# Altium project Controller-RK3562.PrjPcb (part 7 of 8)

## Sheet ANTI-FALL-IR-SENSORs.SchDoc
size A4; SheetNumber: 19; SheetTotal: 32
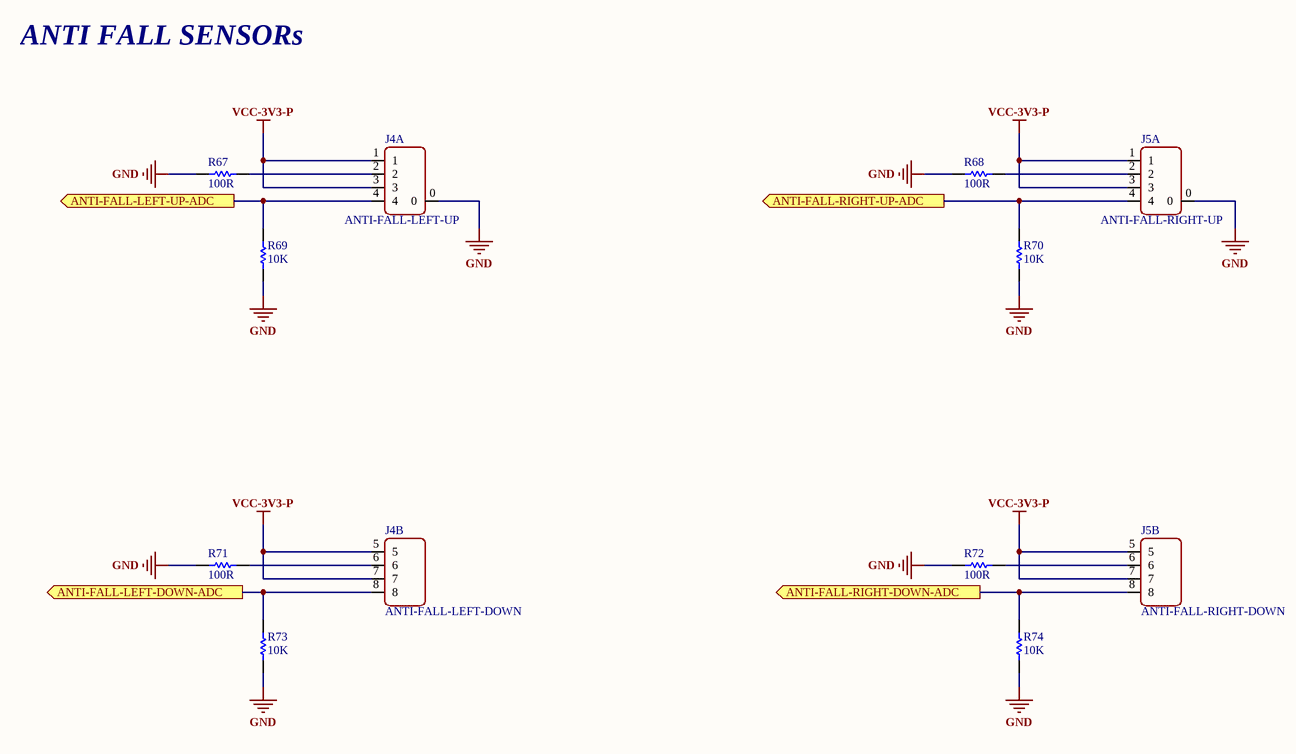
[diagram p24: ANTI-FALL-IR-SENSORs.SchDoc]

### Parts
J4  ANTI-FALL-LEFT-UP  [CONN-SMD_8P-P1.50_ZX-ZH1.5-8PWT]  (parts A,B of 2)
J5  ANTI-FALL-RIGHT-UP  [CONN-SMD_8P-P1.50_ZX-ZH1.5-8PWT]  (parts A,B of 2)
R67  100R  [RES-0402]
R68  100R  [RES-0402]
R69  10K  [RES-0402]
R70  10K  [RES-0402]
R71  100R  [RES-0402]
R72  100R  [RES-0402]
R73  10K  [RES-0402]
R74  10K  [RES-0402]

### Ports
ANTI-FALL-LEFT-DOWN-ADC (out, see Controller-RK3562-TOP[3A], STM32G070RBT6[1B]), ANTI-FALL-LEFT-UP-ADC (out, see Controller-RK3562-TOP[3A], STM32G070RBT6[1B]), ANTI-FALL-RIGHT-DOWN-ADC (out, see Controller-RK3562-TOP[3A], STM32G070RBT6[1B]), ANTI-FALL-RIGHT-UP-ADC (out, see Controller-RK3562-TOP[3A], STM32G070RBT6[1B])

### Nets
GND: J4.0 J5.0 R67.1 R68.1 R69.1 R70.1 R71.1 R72.1 R73.1 R74.1
VCC-3V3-P: J4.1 J4.3 J4.5 J4.7 J5.1 J5.3 J5.5 J5.7
NetJ4_2: J4.2 R67.2
NetJ4_4: J4.4 R69.2 ; port ANTI-FALL-LEFT-UP-ADC
NetJ4_6: J4.6 R71.2
NetJ4_8: J4.8 R73.2 ; port ANTI-FALL-LEFT-DOWN-ADC
NetJ5_2: J5.2 R68.2
NetJ5_4: J5.4 R70.2 ; port ANTI-FALL-RIGHT-UP-ADC
NetJ5_6: J5.6 R72.2
NetJ5_8: J5.8 R74.2 ; port ANTI-FALL-RIGHT-DOWN-ADC

### Notes on the sheet
- ANTI FALL SENSORs

### Library data of the parts
J4 J5 = HDRx8-2: ZX-ZH1.5-8PWT; Manufacturer: *; SupplierPartNumber: *; Supplier: *; VoltageRate: *
R67-R74 = Resistor-1: ManufacturingPartNumber: *; Manufacturer: *; SupplierPartNumber: *; Supplier: *; VoltageRate: *

## Sheet SIDE-PROXIMITY-IR-SENSOR .SchDoc
size A4; SheetNumber: 20; SheetTotal: 32
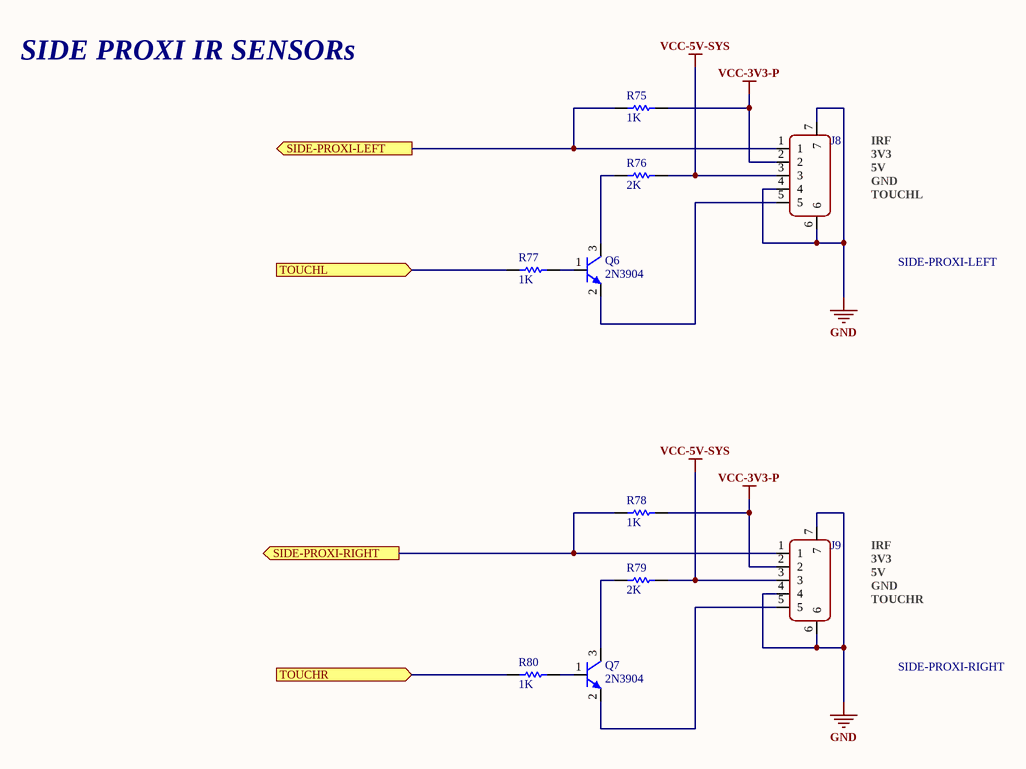
[diagram p25: SIDE-PROXIMITY-IR-SENSOR .SchDoc]

### Parts
J8  SIDE-PROXI-LEFT  [CONN-SMD_5P-P1.50_ZX-ZH1.5-5PWT]
J9  SIDE-PROXI-RIGHT  [CONN-SMD_5P-P1.50_ZX-ZH1.5-5PWT]
Q6  2N3904  [SOT23-3D]
Q7  2N3904  [SOT23-3D]
R75  1K  [RES-0402]
R76  2K  [RES-0402]
R77  1K  [RES-0402]
R78  1K  [RES-0402]
R79  2K  [RES-0402]
R80  1K  [RES-0402]

### Ports
SIDE-PROXI-LEFT (out, see Controller-RK3562-TOP[4A]), SIDE-PROXI-RIGHT (out, see Controller-RK3562-TOP[4A]), TOUCHL (in, see Controller-RK3562-TOP[4A]), TOUCHR (in, see Controller-RK3562-TOP[4A])

### Nets
GND: J8.4 J8.6 J8.7 J9.4 J9.6 J9.7
VCC-3V3-P: J8.2 J9.2 R75.2 R78.2
VCC-5V-SYS: J8.3 J9.3 R76.1 R79.1
NetJ8_1: J8.1 R75.1 ; port SIDE-PROXI-LEFT
NetJ8_5: J8.5 Q6.2(E)
NetJ9_1: J9.1 R78.1 ; port SIDE-PROXI-RIGHT
NetJ9_5: J9.5 Q7.2(E)
NetQ6_1: Q6.1(B) R77.2
NetQ6_3: Q6.3(C) R76.2
NetQ7_1: Q7.1(B) R80.2
NetQ7_3: Q7.3(C) R79.2
NetR77_1: R77.1 ; port TOUCHL
NetR80_1: R80.1 ; port TOUCHR

### Notes on the sheet
- SIDE PROXI IR SENSORs
- IRF
- 3V3
- 5V
- GND
- TOUCHL
- TOUCHR

### Library data of the parts
J8 J9 = HDRx5: ZX-ZH1.5-5PWT; ManufacturingPartNumber: *; Manufacturer: *; SupplierPartNumber: *; Supplier: *; VoltageRate: *
Q6 Q7 = NPN-SOT23: ManufacturingPartNumber: *; Manufacturer: *; SupplierPartNumber: *; Supplier: *; VoltageRate: *
R75-R80 = Resistor-1: ManufacturingPartNumber: *; Manufacturer: *; SupplierPartNumber: *; Supplier: *; VoltageRate: *

## Sheet WATER-PUMP .SchDoc
size A4; SheetNumber: 21; SheetTotal: 32
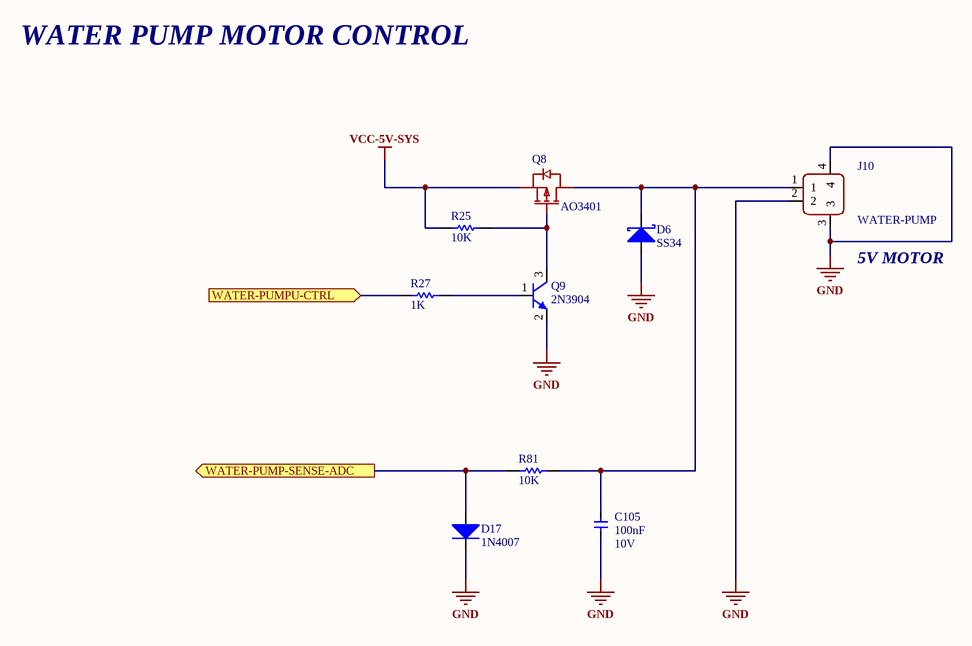
[diagram p26: WATER-PUMP .SchDoc]

### Parts
C105  100nF  VoltageRate: 10V  [CAP-0402]
D6  SS34  [SMA]
D17  1N4007  [SOD123]
J10  WATER-PUMP  [CONN-SMD_2P-P1.50_ZX-ZH1.5-2PWT]
Q8  AO3401  [SOT23-3D]
Q9  2N3904  [SOT23-3D]
R25  10K  [RES-0402]
R27  1K  [RES-0402]
R81  10K  [RES-0402]

### Ports
WATER-PUMP-SENSE-ADC (out, see Controller-RK3562-TOP[2B]), WATER-PUMPU-CTRL (in, see Controller-RK3562-TOP[2B])

### Nets
GND: C105.1 D6.1(A) D17.2(K) J10.2 J10.3 J10.4 Q9.2(E)
VCC-5V-SYS: Q8.2(S) R25.2
NetC105_2: C105.2 D6.2(K) J10.1 Q8.3(D) R81.1
NetD17_1: D17.1(A) R81.2 ; port WATER-PUMP-SENSE-ADC
NetQ8_1: Q8.1(G) Q9.3(C) R25.1
NetQ9_1: Q9.1(B) R27.1
NetR27_2: R27.2 ; port WATER-PUMPU-CTRL

### Notes on the sheet
- WATER PUMP MOTOR CONTROL
- (near J10) 5V MOTOR

### Library data of the parts
C105 = Capacitor-1: ManufacturingPartNumber: *; Manufacturer: *; SupplierPartNumber: *; Supplier: *
D6 = DIODE-2: ManufacturingPartNumber: *; Manufacturer: *; SupplierPartNumber: *; Supplier: *; VoltageRate: *
D17 = DIODE-1: ManufacturingPartNumber: *; Manufacturer: *; SupplierPartNumber: *; Supplier: *; VoltageRate: *
J10 = HDRx2: ZX-ZH1.5-2PWT; ManufacturingPartNumber: *; Manufacturer: *; SupplierPartNumber: *; Supplier: *; VoltageRate: *
Q8 = P-MOS-SOT23: ManufacturingPartNumber: *; Manufacturer: *; SupplierPartNumber: *; Supplier: *; VoltageRate: *
Q9 = NPN-SOT23: ManufacturingPartNumber: *; Manufacturer: *; SupplierPartNumber: *; Supplier: *; VoltageRate: *
R25 R27 R81 = Resistor-1: ManufacturingPartNumber: *; Manufacturer: *; SupplierPartNumber: *; Supplier: *; VoltageRate: *

## Sheet MAIN-BRUSH-MOTOR .SchDoc
size A4; SheetNumber: 22; SheetTotal: 32
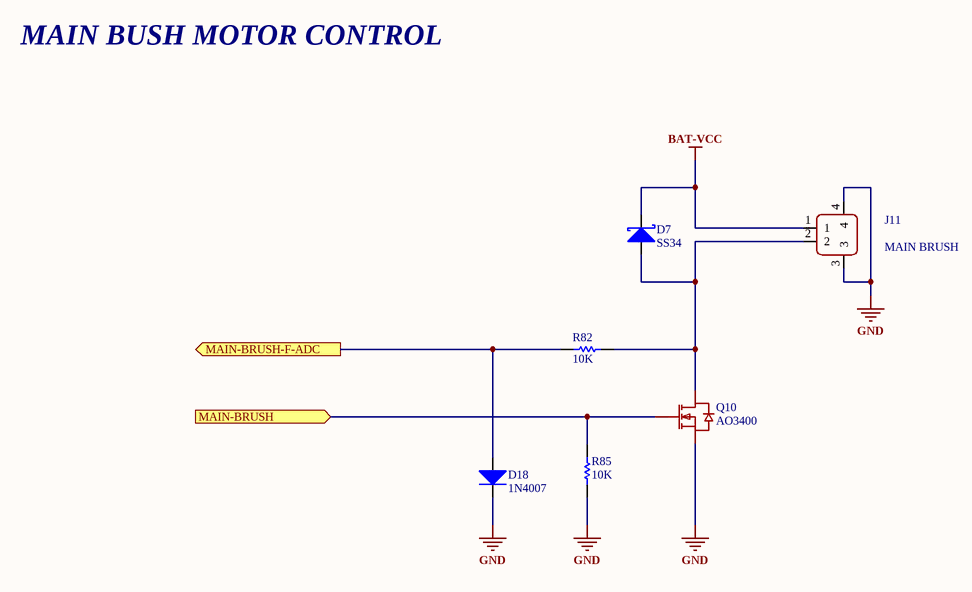
[diagram p27: MAIN-BRUSH-MOTOR .SchDoc]

### Parts
D7  SS34  [SMA]
D18  1N4007  [SOD123]
J11  MAIN BRUSH  [CONN-SMD_2P-P2.00_XUNPU_WAFER-PH2.0-2PWB]
Q10  AO3400  [SOT23-3D]
R82  10K  [RES-0402]
R85  10K  [RES-0402]

### Ports
MAIN-BRUSH (in, see Controller-RK3562-TOP[2B]), MAIN-BRUSH-F-ADC (out, see Controller-RK3562-TOP[2B])

### Nets
BAT-VCC: D7.2(K) J11.1
GND: D18.2(K) J11.3 J11.4 Q10.2(S) R85.2
NetD7_1: D7.1(A) J11.2 Q10.3(D) R82.2
NetD18_1: D18.1(A) R82.1 ; port MAIN-BRUSH-F-ADC
NetQ10_1: Q10.1(G) R85.1 ; port MAIN-BRUSH

### Notes on the sheet
- MAIN BUSH MOTOR CONTROL

### Library data of the parts
D7 = DIODE-2: ManufacturingPartNumber: *; Manufacturer: *; SupplierPartNumber: *; Supplier: *; VoltageRate: *
D18 = DIODE-1: ManufacturingPartNumber: *; Manufacturer: *; SupplierPartNumber: *; Supplier: *; VoltageRate: *
J11 = HDRx2: ZX-ZH1.5-2PWT; ManufacturingPartNumber: *; Manufacturer: *; SupplierPartNumber: *; Supplier: *; VoltageRate: *
Q10 = N-MOS-SOT23: ManufacturingPartNumber: *; Manufacturer: *; SupplierPartNumber: *; Supplier: *; VoltageRate: *
R82 R85 = Resistor-1: ManufacturingPartNumber: *; Manufacturer: *; SupplierPartNumber: *; Supplier: *; VoltageRate: *

## Sheet WHEEL-MOTORs .SchDoc
size A4; SheetNumber: 23; SheetTotal: 32
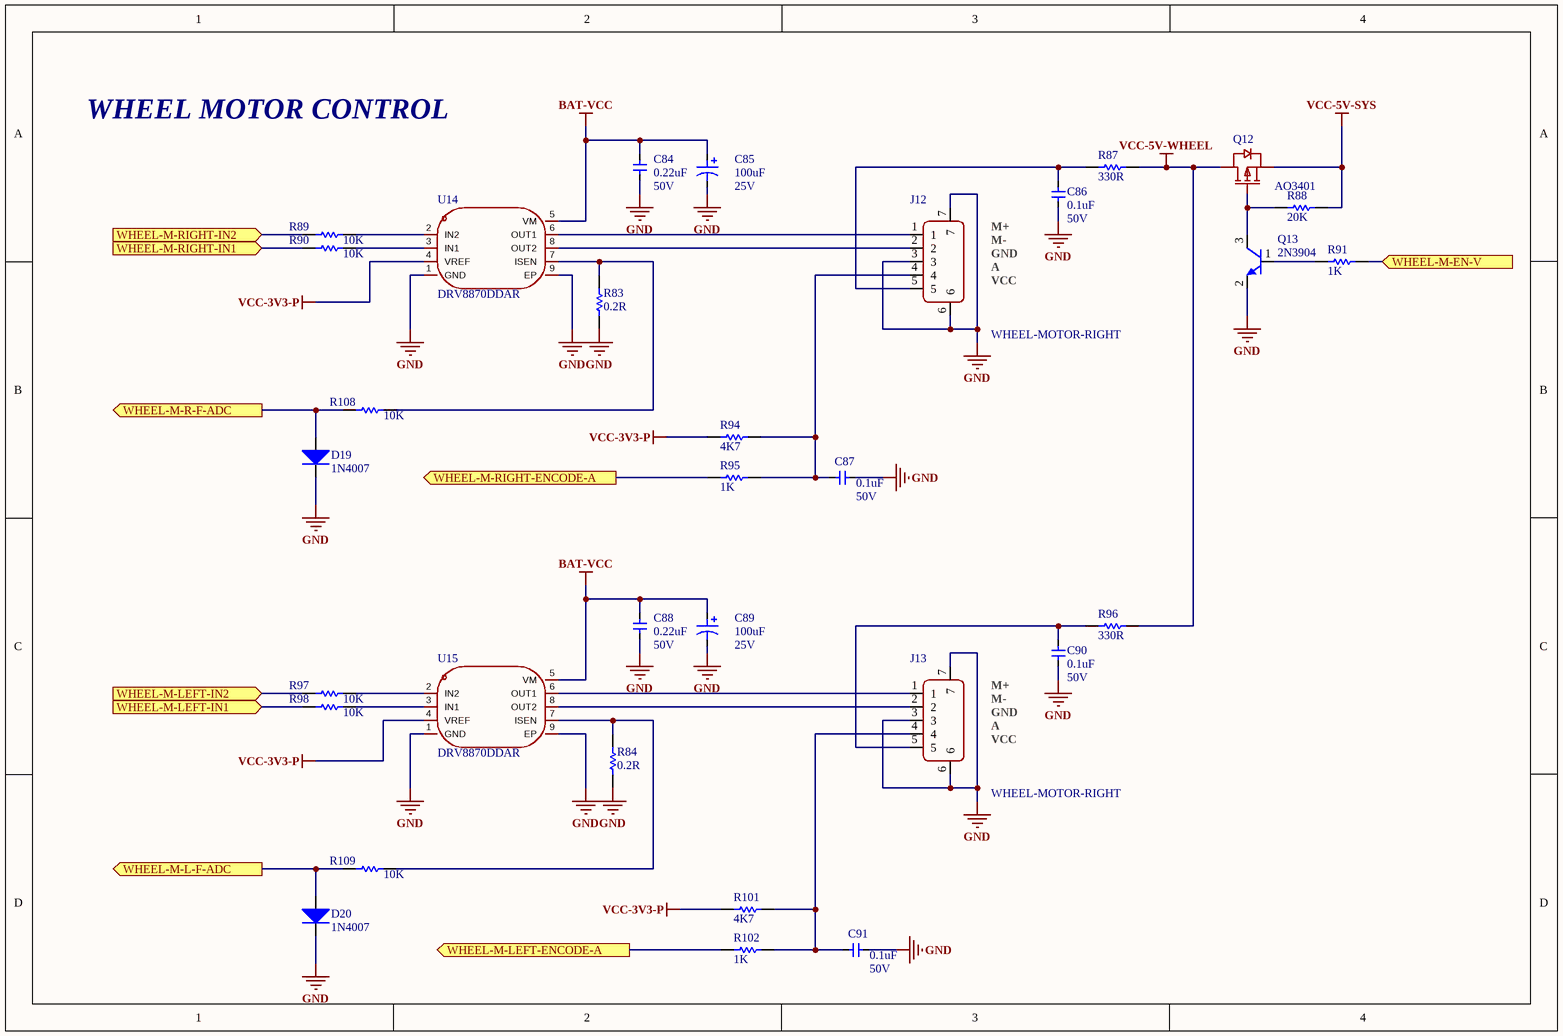
[diagram p28: WHEEL-MOTORs .SchDoc]

### Parts
C84  0.22uF  VoltageRate: 50V  [CAP-0402]
C85  100uF  VoltageRate: 25V  [CAP-SMD_BD6.3-L6.6-W6.6-FD]
C86  0.1uF  VoltageRate: 50V  [CAP-0402]
C87  0.1uF  VoltageRate: 50V  [CAP-0402]
C88  0.22uF  VoltageRate: 50V  [CAP-0402]
C89  100uF  VoltageRate: 25V  [CAP-SMD_BD6.3-L6.6-W6.6-FD]
C90  0.1uF  VoltageRate: 50V  [CAP-0402]
C91  0.1uF  VoltageRate: 50V  [CAP-0402]
D19  1N4007  [SOD123]
D20  1N4007  [SOD123]
J12  WHEEL-MOTOR-RIGHT  [CONN-SMD_5P-P1.50_ZX-ZH1.5-5PWT]
J13  WHEEL-MOTOR-RIGHT  [CONN-SMD_5P-P1.50_ZX-ZH1.5-5PWT]
Q12  AO3401  [SOT23-3D]
Q13  2N3904  [SOT23-3D]
R83  0.2R  [RES-0603]
R84  0.2R  [RES-0603]
R87  330R  [RES-0603]
R88  20K  [RES-0402]
R89  10K  [RES-0402]
R90  10K  [RES-0402]
R91  1K  [RES-0402]
R94  4K7  [RES-0402]
R95  1K  [RES-0402]
R96  330R  [RES-0603]
R97  10K  [RES-0402]
R98  10K  [RES-0402]
R101  4K7  [RES-0402]
R102  1K  [RES-0402]
R108  10K  [RES-0402]
R109  10K  [RES-0402]
U14  DRV8870DDAR  [HSOP-8_L5.0-W4.0-P1.27-LS6.2-BL-EP]
U15  DRV8870DDAR  [HSOP-8_L5.0-W4.0-P1.27-LS6.2-BL-EP]

### Ports
WHEEL-M-EN-V (in, see Controller-RK3562-TOP[2B], STM32G070RBT6[2C]), WHEEL-M-L-F-ADC (out, see Controller-RK3562-TOP[2C], STM32G070RBT6[2C]), WHEEL-M-LEFT-ENCODE-A (out, see Controller-RK3562-TOP[2C], STM32G070RBT6[1B]), WHEEL-M-LEFT-IN1 (in, see Controller-RK3562-TOP[2B], STM32G070RBT6[2B]), WHEEL-M-LEFT-IN2 (in, see Controller-RK3562-TOP[2B], STM32G070RBT6[2B]), WHEEL-M-R-F-ADC (out, see Controller-RK3562-TOP[2C], STM32G070RBT6[2B]), WHEEL-M-RIGHT-ENCODE-A (out, see Controller-RK3562-TOP[2B], STM32G070RBT6[1B]), WHEEL-M-RIGHT-IN1 (in, see Controller-RK3562-TOP[2B], STM32G070RBT6[2C]), WHEEL-M-RIGHT-IN2 (in, see Controller-RK3562-TOP[2B], STM32G070RBT6[2C])

### Nets
BAT-VCC: C84.2 C85.1 C88.2 C89.1 U14.5(VM) U15.5(VM)
GND: C84.1 C85.2 C86.2 C87.1 C88.1 C89.2 C90.2 C91.1 D19.2(K) D20.2(K) J12.3 J12.6 J12.7 J13.3 J13.6 J13.7 Q13.2(E) R83.1 R84.1 U14.1(GND) U14.9(EP) U15.1(GND) U15.9(EP)
VCC-3V3-P: R94.1 R101.1 U14.4(VREF) U15.4(VREF)
VCC-5V-SYS: Q12.2(S) R88.2
VCC-5V-WHEEL: Q12.3(D) R87.2 R96.2
NetC86_1: C86.1 J12.5 R87.1
NetC87_2: C87.2 J12.4 R94.2 R95.2
NetC90_1: C90.1 J13.5 R96.1
NetC91_2: C91.2 J13.4 R101.2 R102.2
NetD19_1: D19.1(A) R108.1 ; port WHEEL-M-R-F-ADC
NetD20_1: D20.1(A) R109.1 ; port WHEEL-M-L-F-ADC
NetJ12_1: J12.1 U14.6(OUT1)
NetJ12_2: J12.2 U14.8(OUT2)
NetJ13_1: J13.1 U15.6(OUT1)
NetJ13_2: J13.2 U15.8(OUT2)
NetQ12_1: Q12.1(G) Q13.3(C) R88.1
NetQ13_1: Q13.1(B) R91.1
NetR83_2: R83.2 R108.2 U14.7(ISEN)
NetR84_2: R84.2 R109.2 U15.7(ISEN)
NetR89_1: R89.1 ; port WHEEL-M-RIGHT-IN2
NetR89_2: R89.2 U14.2(IN2)
NetR90_1: R90.1 ; port WHEEL-M-RIGHT-IN1
NetR90_2: R90.2 U14.3(IN1)
NetR91_2: R91.2 ; port WHEEL-M-EN-V
NetR95_1: R95.1 ; port WHEEL-M-RIGHT-ENCODE-A
NetR97_1: R97.1 ; port WHEEL-M-LEFT-IN2
NetR97_2: R97.2 U15.2(IN2)
NetR98_1: R98.1 ; port WHEEL-M-LEFT-IN1
NetR98_2: R98.2 U15.3(IN1)
NetR102_1: R102.1 ; port WHEEL-M-LEFT-ENCODE-A

### Notes on the sheet
- WHEEL MOTOR CONTROL
- M+
- (near J12) M-
- (near J12) GND
- (near J12) A
- (near J12) VCC
- (near J13) M-
- (near J13) GND
- (near J13) A
- (near J13) VCC

### Library data of the parts
C84 C86-C88 C90 C91 = Capacitor-1: ManufacturingPartNumber: *; Manufacturer: *; SupplierPartNumber: *; Supplier: *
C85 C89 = Capacitor-2: ManufacturingPartNumber: *; Manufacturer: *; SupplierPartNumber: *; Supplier: *
D19 D20 = DIODE-1: ManufacturingPartNumber: *; Manufacturer: *; SupplierPartNumber: *; Supplier: *; VoltageRate: *
J12 J13 = HDRx5: ManufacturingPartNumber: *; Manufacturer: *; SupplierPartNumber: *; Supplier: *; VoltageRate: *
Q12 = P-MOS-SOT23: ManufacturingPartNumber: *; Manufacturer: *; SupplierPartNumber: *; Supplier: *; VoltageRate: *
Q13 = NPN-SOT23: ManufacturingPartNumber: *; Manufacturer: *; SupplierPartNumber: *; Supplier: *; VoltageRate: *
R83 R84 R87-R91 R94-R98 R101 R102 R108 R109 = Resistor-1: ManufacturingPartNumber: *; Manufacturer: *; SupplierPartNumber: *; Supplier: *; VoltageRate: *
U14 U15 = DRV8870: ManufacturingPartNumber: *; Manufacturer: *; SupplierPartNumber: *; Supplier: *; VoltageRate: *

## Sheet MAIN-FAN .SchDoc
size A4; SheetNumber: 24; SheetTotal: 32
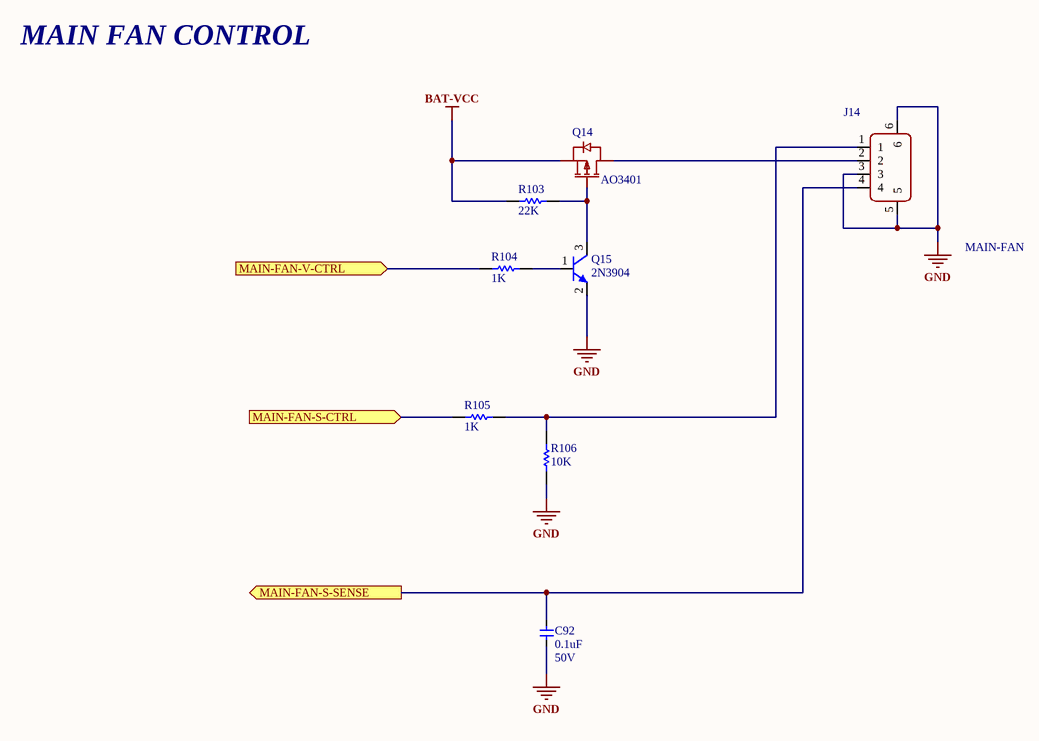
[diagram p29: MAIN-FAN .SchDoc]

### Parts
C92  0.1uF  VoltageRate: 50V  [CAP-0402]
J14  MAIN-FAN  [CONN-SMD_4P-P2.00_XUNPU_WAFER-PH2.0-4PWB]
Q14  AO3401  [SOT23-3D]
Q15  2N3904  [SOT23-3D]
R103  22K  [RES-0402]
R104  1K  [RES-0402]
R105  1K  [RES-0402]
R106  10K  [RES-0402]

### Ports
MAIN-FAN-S-CTRL (in, see Controller-RK3562-TOP[2C]), MAIN-FAN-S-SENSE (out, see Controller-RK3562-TOP[2C]), MAIN-FAN-V-CTRL (in, see Controller-RK3562-TOP[2C])

### Nets
BAT-VCC: Q14.2(S) R103.1
GND: C92.2 J14.3 J14.5 J14.6 Q15.2(E) R106.1
NetC92_1: C92.1 J14.4 ; port MAIN-FAN-S-SENSE
NetJ14_1: J14.1 R105.1 R106.2
NetJ14_2: J14.2 Q14.3(D)
NetQ14_1: Q14.1(G) Q15.3(C) R103.2
NetQ15_1: Q15.1(B) R104.2
NetR104_1: R104.1 ; port MAIN-FAN-V-CTRL
NetR105_2: R105.2 ; port MAIN-FAN-S-CTRL

### Notes on the sheet
- MAIN FAN CONTROL

### Library data of the parts
C92 = Capacitor-1: ManufacturingPartNumber: *; Manufacturer: *; SupplierPartNumber: *; Supplier: *
J14 = HDRx4: ManufacturingPartNumber: *; Manufacturer: *; SupplierPartNumber: *; Supplier: *; VoltageRate: *
Q14 = P-MOS-SOT23: ManufacturingPartNumber: *; Manufacturer: *; SupplierPartNumber: *; Supplier: *; VoltageRate: *
Q15 = NPN-SOT23: ManufacturingPartNumber: *; Manufacturer: *; SupplierPartNumber: *; Supplier: *; VoltageRate: *
R103-R106 = Resistor-1: ManufacturingPartNumber: *; Manufacturer: *; SupplierPartNumber: *; Supplier: *; VoltageRate: *

## Sheet SIDE-BRUSH-MOTORs .SchDoc
size A4; SheetNumber: 25; SheetTotal: 32
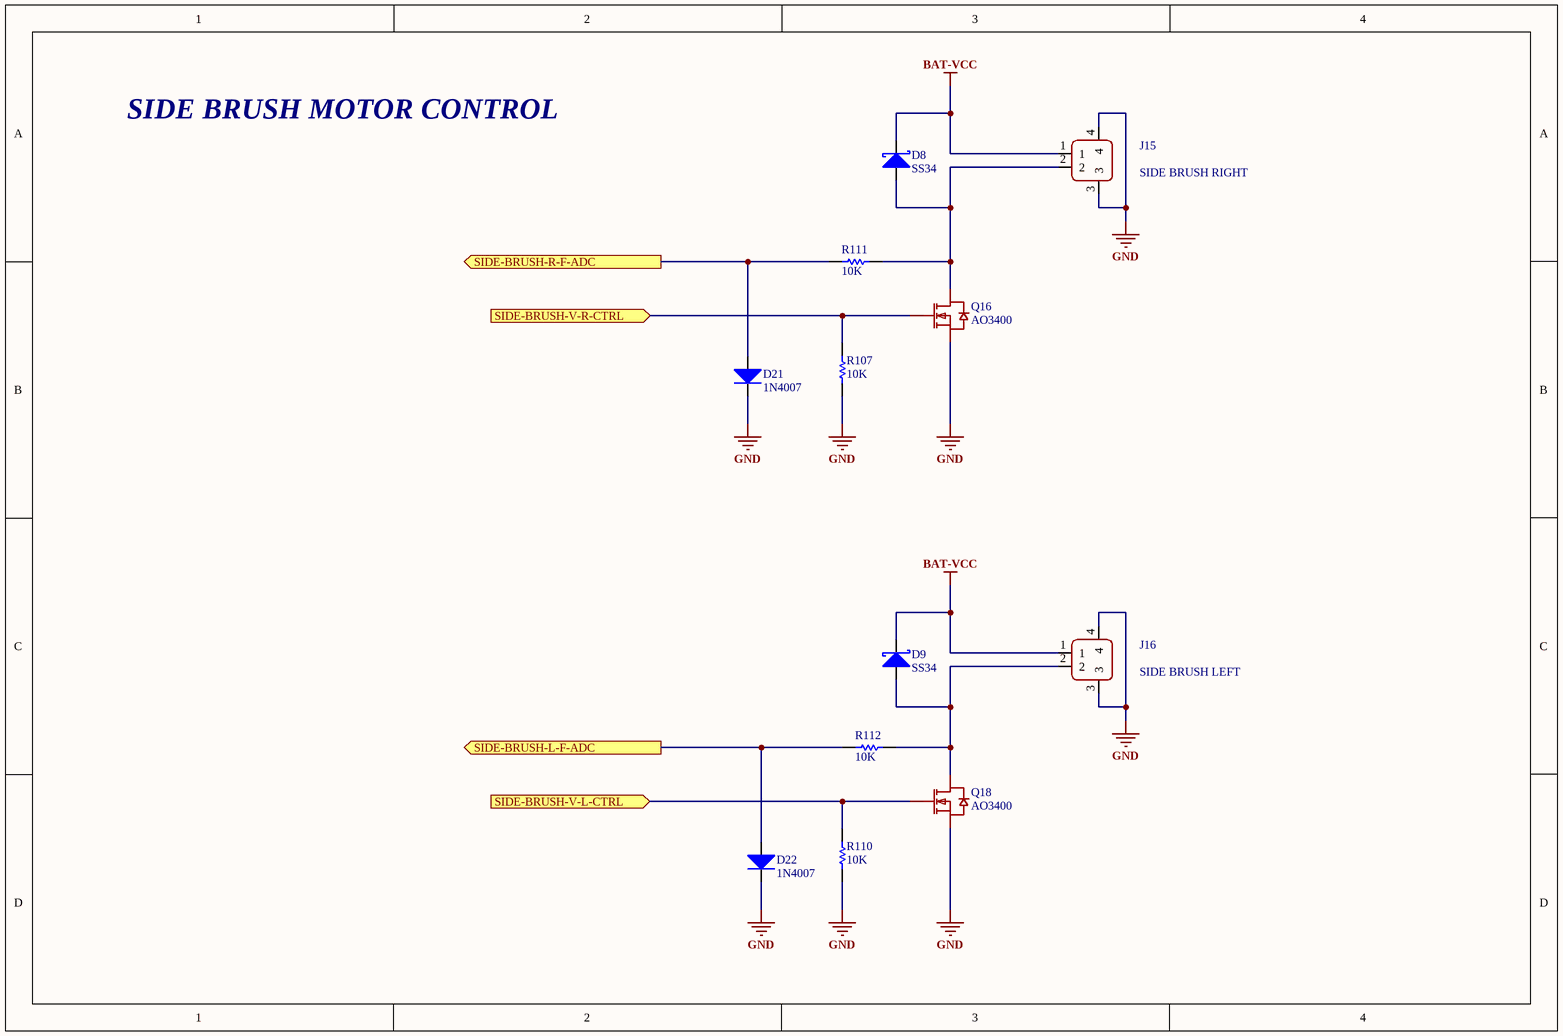
[diagram p30: SIDE-BRUSH-MOTORs .SchDoc]

### Parts
D8  SS34  [SMA]
D9  SS34  [SMA]
D21  1N4007  [SOD123]
D22  1N4007  [SOD123]
J15  SIDE BRUSH RIGHT  [CONN-SMD_2P-P1.50_ZX-ZH1.5-2PWT]
J16  SIDE BRUSH LEFT  [CONN-SMD_2P-P1.50_ZX-ZH1.5-2PWT]
Q16  AO3400  [SOT23-3D]
Q18  AO3400  [SOT23-3D]
R107  10K  [RES-0402]
R110  10K  [RES-0402]
R111  10K  [RES-0402]
R112  10K  [RES-0402]

### Ports
SIDE-BRUSH-L-F-ADC (out, see Controller-RK3562-TOP[2C]), SIDE-BRUSH-R-F-ADC (out, see Controller-RK3562-TOP[2C]), SIDE-BRUSH-V-L-CTRL (in, see Controller-RK3562-TOP[2C]), SIDE-BRUSH-V-R-CTRL (in, see Controller-RK3562-TOP[2C])

### Nets
BAT-VCC: D8.2(K) D9.2(K) J15.1 J16.1
GND: D21.2(K) D22.2(K) J15.3 J15.4 J16.3 J16.4 Q16.2(S) Q18.2(S) R107.1 R110.1
NetD8_1: D8.1(A) J15.2 Q16.3(D) R111.1
NetD9_1: D9.1(A) J16.2 Q18.3(D) R112.1
NetD21_1: D21.1(A) R111.2 ; port SIDE-BRUSH-R-F-ADC
NetD22_1: D22.1(A) R112.2 ; port SIDE-BRUSH-L-F-ADC
NetQ16_1: Q16.1(G) R107.2 ; port SIDE-BRUSH-V-R-CTRL
NetQ18_1: Q18.1(G) R110.2 ; port SIDE-BRUSH-V-L-CTRL

### Notes on the sheet
- SIDE BRUSH MOTOR CONTROL

### Library data of the parts
D8 D9 = DIODE-2: ManufacturingPartNumber: *; Manufacturer: *; SupplierPartNumber: *; Supplier: *; VoltageRate: *
D21 D22 = DIODE-1: ManufacturingPartNumber: *; Manufacturer: *; SupplierPartNumber: *; Supplier: *; VoltageRate: *
J15 J16 = HDRx2: ManufacturingPartNumber: *; Manufacturer: *; SupplierPartNumber: *; Supplier: *; VoltageRate: *
Q16 Q18 = N-MOS-SOT23: ManufacturingPartNumber: *; Manufacturer: *; SupplierPartNumber: *; Supplier: *; VoltageRate: *
R107 R110-R112 = Resistor-1: ManufacturingPartNumber: *; Manufacturer: *; SupplierPartNumber: *; Supplier: *; VoltageRate: *

## Sheet LiDAR .SchDoc
size A4; SheetNumber: 26; SheetTotal: 32
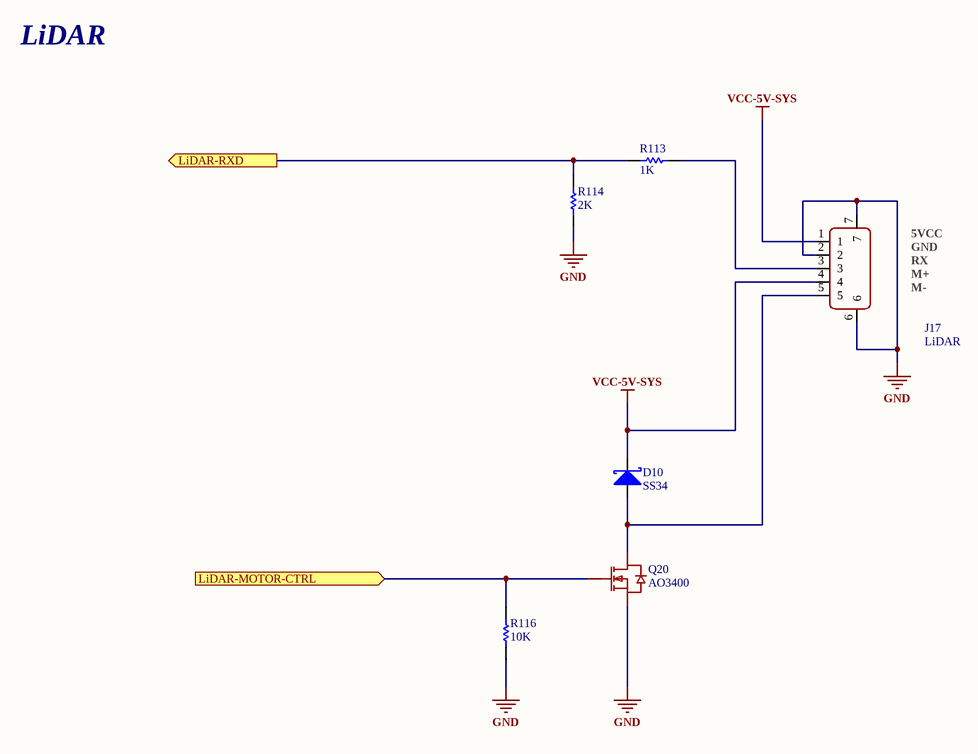
[diagram p31: LiDAR .SchDoc]

### Parts
D10  SS34  [SMA]
J17  LiDAR  [CONN-SMD_5P-P1.25_XUNPU_WAFER-GH1.25-5PWB]
Q20  AO3400  [SOT23-3D]
R113  1K  [RES-0402]
R114  2K  [RES-0402]
R116  10K  [RES-0402]

### Ports
LiDAR-MOTOR-CTRL (in, see Controller-RK3562-TOP[7B]), LiDAR-RXD (out, see Controller-RK3562-TOP[7B], CONTROLLER-RK3562[3C])

### Nets
GND: J17.2 J17.6 J17.7 Q20.2(S) R114.1 R116.1
VCC-5V-SYS: D10.2(K) J17.1 J17.4
LiDAR-M-CTRL: Q20.1(G) R116.2 ; port LiDAR-MOTOR-CTRL
UART4_RXD_M0: R113.1 R114.2 ; port LiDAR-RXD
NetD10_1: D10.1(A) J17.5 Q20.3(D)
NetJ17_3: J17.3 R113.2

### Notes on the sheet
- LiDAR
- 5VCC
- GND
- RX
- M+
- M-

### Library data of the parts
D10 = DIODE-2: ManufacturingPartNumber: *; Manufacturer: *; SupplierPartNumber: *; Supplier: *; VoltageRate: *
J17 = HDRx5: WAFER-GH1.25-5PWB; ManufacturingPartNumber: *; Manufacturer: *; SupplierPartNumber: *; Supplier: *; VoltageRate: *
Q20 = N-MOS-SOT23: ManufacturingPartNumber: *; Manufacturer: *; SupplierPartNumber: *; Supplier: *; VoltageRate: *
R113 R114 R116 = Resistor-1: ManufacturingPartNumber: *; Manufacturer: *; SupplierPartNumber: *; Supplier: *; VoltageRate: *

## Sheet SPEAKER-MIC.SchDoc
size A4; SheetNumber: 27; SheetTotal: 32
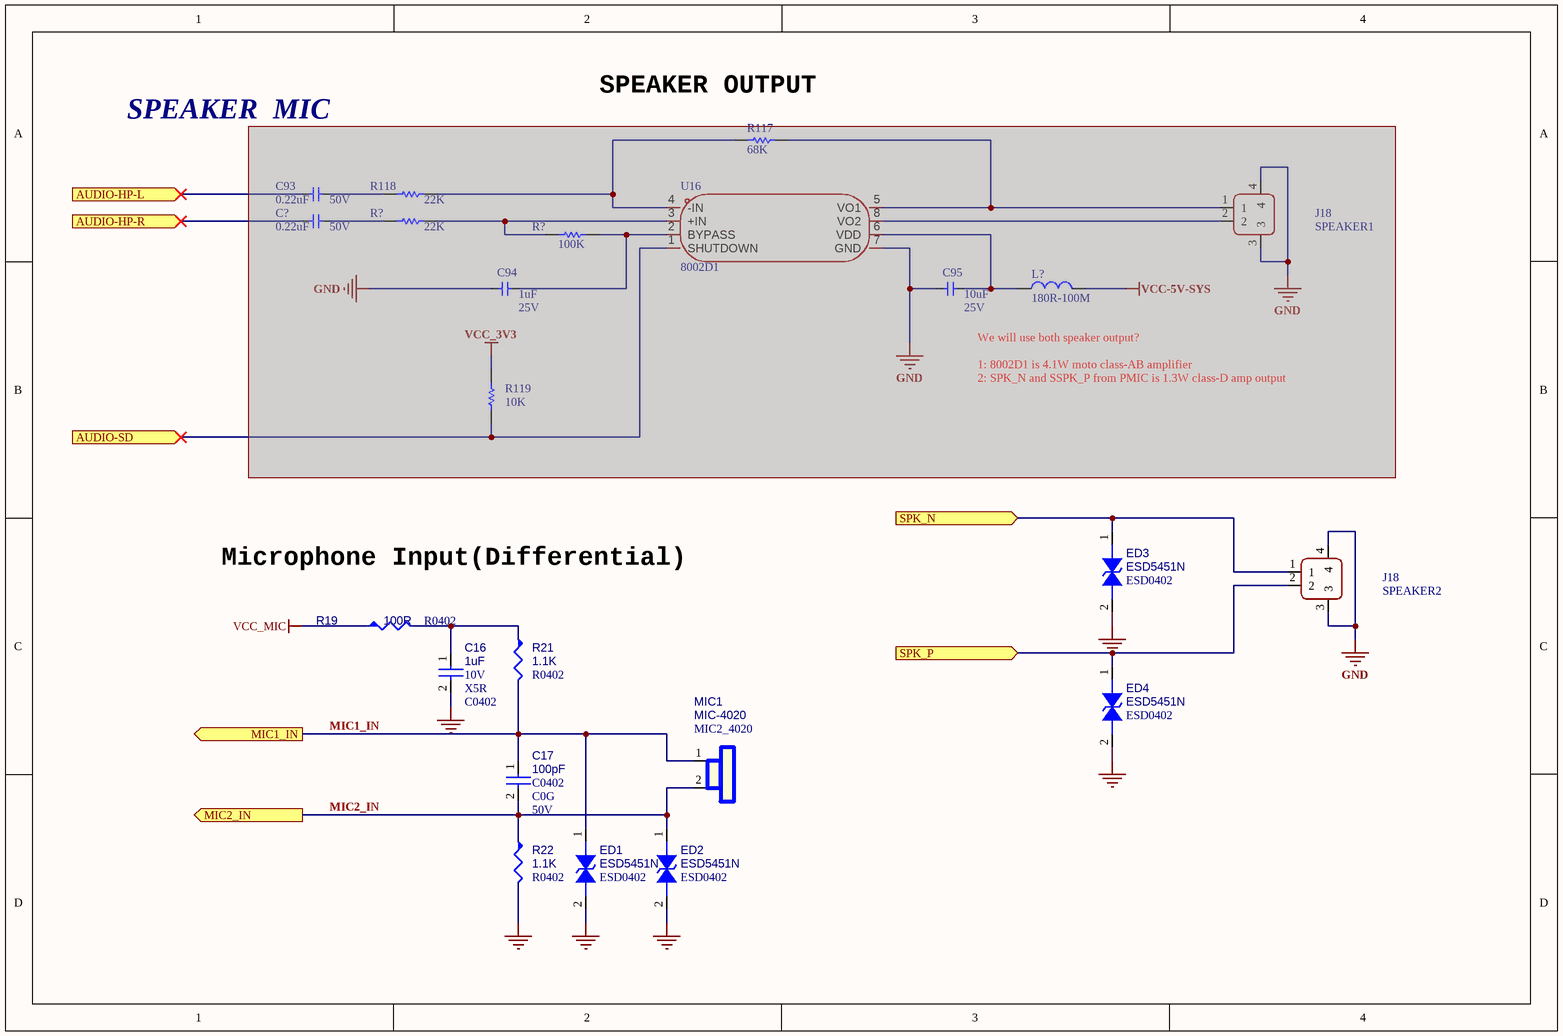
[diagram p32: SPEAKER-MIC.SchDoc]

### Parts
(Parts that share a designator on the sheet are numbered #1, #2 ... from top to bottom, then left to right.)
C16  1uF  Dielectric: X5R  Voltage: 10V  [C0402]
C17  100pF  Dielectric: C0G  Voltage: 50V  [C0402]
C93  0.22uF  VoltageRate: 50V  [CAP-0603]  (masked out: inside a compile mask, not in the netlist)
C94  1uF  VoltageRate: 25V  [CAP-0402]  (masked out: inside a compile mask, not in the netlist)
C95  10uF  VoltageRate: 25V  [CAP-0402]  (masked out: inside a compile mask, not in the netlist)
C?  0.22uF  VoltageRate: 50V  [CAP-0603]  (masked out: inside a compile mask, not in the netlist)
ED1  ESD5451N  [ESD0402]
ED2  ESD5451N  [ESD0402]
ED3  ESD5451N  [ESD0402]
ED4  ESD5451N  [ESD0402]
J18#1  SPEAKER1  (masked out: inside a compile mask, not in the netlist)
J18#2  SPEAKER2  [CONN-SMD_2P-P1.00_HX-1.0-2P-WT]
L?  180R-100M  (masked out: inside a compile mask, not in the netlist)
MIC1  MIC-4020  PCB Footprint: MIC2_4020  [MIC-SMD_BD4.0-4013_SMDA]
R19  100R  [R0402]
R21  1.1K  [R0402]
R22  1.1K  [R0402]
R117  68K  [RES-0402]  (masked out: inside a compile mask, not in the netlist)
R118  22K  [RES-0402]  (masked out: inside a compile mask, not in the netlist)
R119  10K  [RES-0402]  (masked out: inside a compile mask, not in the netlist)
R?#1  22K  [RES-0402]  (masked out: inside a compile mask, not in the netlist)
R?#2  100K  [RES-0402]  (masked out: inside a compile mask, not in the netlist)
U16  8002D1  [SOP-8_L4.9-W3.9-P1.27-LS6.0-BL-1]  (masked out: inside a compile mask, not in the netlist)

### Ports
AUDIO-HP-L (in, see Controller-RK3562-TOP[7C], CONTROLLER-RK3562[1C]), AUDIO-HP-R (in, see Controller-RK3562-TOP[7C], CONTROLLER-RK3562[1C]), AUDIO-SD (in, see Controller-RK3562-TOP[7C], CONTROLLER-RK3562[3C]), MIC1_IN (out, see Controller-RK3562-TOP[7C], CONTROLLER-RK3562[1C], RK-POWER-SUPPLY[4A]), MIC2_IN (out, see Controller-RK3562-TOP[7C], CONTROLLER-RK3562[1C], RK-POWER-SUPPLY[4A]), SPK_N (in, see Controller-RK3562-TOP[7C], CONTROLLER-RK3562[1C]), SPK_P (in, see Controller-RK3562-TOP[7C], CONTROLLER-RK3562[1C])

### Nets
GND: C16.2 ED1.2 ED2.2 ED3.2 ED4.2 J18#2.3 J18#2.4 R22.2
VCC_MIC: R19.1
MIC1_IN: C17.1 ED1.1 MIC1.1 R21.2 ; port MIC1_IN
MIC2_IN: C17.2 ED2.1 MIC1.2 R22.1 ; port MIC2_IN
SPKN_OUT: ED3.1 J18#2.1 ; port SPK_N
SPKP_OUT: ED4.1 J18#2.2 ; port SPK_P
NetC16_1: C16.1 R19.2 R21.1

### Notes on the sheet
- (near R117) SPEAKER OUTPUT
- SPEAKER  MIC
- We will use both speaker output?
  1: 8002D1 is 4.1W moto class-AB amplifier
  2: SPK_N and SSPK_P from PMIC is 1.3W class-D amp output
- Microphone Input(Differential)

### Library data of the parts
C16 = CAP NP: cap,1.00uF,+/-10%,10V,X5R,C0402; Part Reference: C7005; Manufacturer: TDK; RK PN: C1005X5R1A105K050BB; Priority: A; Tolerance: 10%; PCB Footprint: C0402; Value: 1uF; Part Type: C0402; Manufacturer PN: C1005X5R1A105K050BB; Created by: JJJ
C17 = CAP NP: cap,100.00pF,+/-10%,50V,C0G,C0402; Part Reference: C7007; Manufacturer PN: C1005C0G1H101K050BA; Manufacturer: TDK; Tolerance: 10%; Priority: A; PCB Footprint: C0402; Value: 100pF; Created by: JJJ; Part Type: C0402; RK PN: C1005C0G1H101K050BA
C93-C95 C? = Capacitor-1: ManufacturingPartNumber: *; Manufacturer: *; SupplierPartNumber: *; Supplier: *
ED1 = DIODE BI_DIR TRIG: 1-Line, Bi-directional, Transient Voltage Suppressors.17.5pF.; Part Reference: ED7008; Manufacturer: WillSemi(韦尔半导体); Priority: A; PCB Footprint: ESD0402; Value: ESD5451N; RK PN: ESD5451N; Part Type: ESD_TVS; Manufacturer PN: ESD5451N; Created by: JJJ
ED2 = DIODE BI_DIR TRIG: 1-Line, Bi-directional, Transient Voltage Suppressors.17.5pF.; Part Reference: ED7009; Manufacturer: WillSemi(韦尔半导体); Priority: A; PCB Footprint: ESD0402; Value: ESD5451N; Created by: JJJ; Manufacturer PN: ESD5451N; Part Type: ESD_TVS; RK PN: ESD5451N
ED3 = DIODE BI_DIR TRIG: 1-Line, Bi-directional, Transient Voltage Suppressors.17.5pF.; Part Reference: ED7010; Manufacturer: WillSemi(韦尔半导体); Priority: A; PCB Footprint: ESD0402; Value: ESD5451N; Created by: JJJ; Manufacturer PN: ESD5451N; Part Type: ESD_TVS; RK PN: ESD5451N
ED4 = DIODE BI_DIR TRIG: 1-Line, Bi-directional, Transient Voltage Suppressors.17.5pF.; Part Reference: ED7011; Manufacturer: WillSemi(韦尔半导体); Priority: A; PCB Footprint: ESD0402; Value: ESD5451N; Created by: JJJ; Manufacturer PN: ESD5451N; Part Type: ESD_TVS; RK PN: ESD5451N
J18#1 J18#2 = HDRx2: ManufacturingPartNumber: *; Manufacturer: *; SupplierPartNumber: *; Supplier: *; VoltageRate: *
L? = INDUCTOR-SMD: ManufacturingPartNumber: *; Manufacturer: *; SupplierPartNumber: *; Supplier: *; VoltageRate: *
MIC1 = MIC: mic 咪头; Part Reference: MIC7001; Manufacturer: 待更新; Priority: A; Value: MIC-4020; RK PN: MIC; Part Type: MIC; Manufacturer Part Number: MIC-4020; Created by: JJJ
R19 = RESISTOR5: 通用厚膜电阻,100R,+/-5%,R0402,1/16W.; Part Reference: R7010; Manufacturer: YAGEO; Manufacturer PN: RC0402JR-07100RL; Tolerance: 5%; RK PN: 901001448; Priority: A; Wattage: 1/16W; PCB Footprint: R0402; Value: 100R; Part Type: 通用厚膜电阻; Created by: YTL
R21 = RESISTOR5: 通用厚膜电阻,1K1,+/-5%,R0402,1/16W.; Part Reference: R7012; Manufacturer: YAGEO; Manufacturer PN: RC0402JR-071K1L; Tolerance: 5%; RK PN: 901001476; Priority: A; Wattage: 1/16W; PCB Footprint: R0402; Value: 1.1K; Part Type: 通用厚膜电阻; Created by: YTL
R22 = RESISTOR5: 通用厚膜电阻,1K1,+/-5%,R0402,1/16W.; Part Reference: R7014; Manufacturer PN: RC0402JR-071K1L; Manufacturer: YAGEO; Tolerance: 5%; Wattage: 1/16W; Priority: A; RK PN: 901001476; PCB Footprint: R0402; Value: 1.1K; Created by: YTL; Part Type: 通用厚膜电阻
R117-R119 R?#1 R?#2 = Resistor-1: ManufacturingPartNumber: *; Manufacturer: *; SupplierPartNumber: *; Supplier: *; VoltageRate: *
U16 = 8002D1: ManufacturingPartNumber: *; Manufacturer: *; SupplierPartNumber: *; Supplier: *; VoltageRate: *

## Sheet BUTTON-LEDs .SchDoc
size A4; SheetNumber: 28; SheetTotal: 32
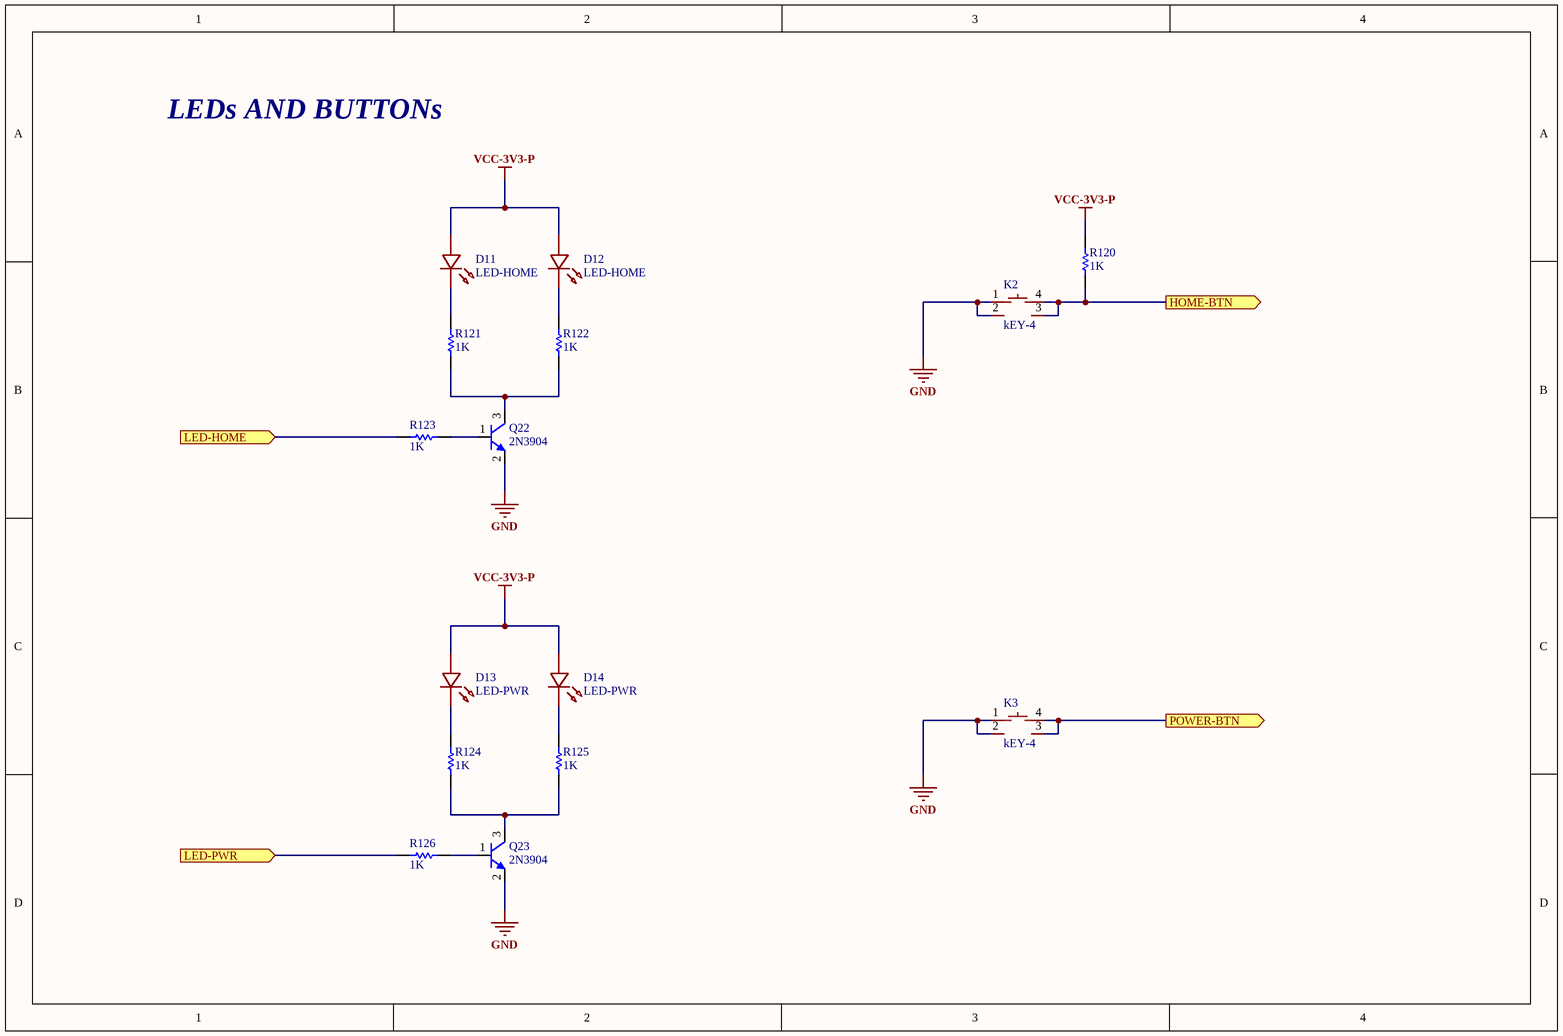
[diagram p33: BUTTON-LEDs .SchDoc]

### Parts
D11  LED-HOME  [LED0603-B]
D12  LED-HOME  [LED0603-B]
D13  LED-PWR  [LED0603-B]
D14  LED-PWR  [LED0603-B]
K2  kEY-4  [KEY-SMD_4P-L6.0-W6.0-P4.50-LS9.0]
K3  kEY-4  [KEY-SMD_4P-L6.0-W6.0-P4.50-LS9.0]
Q22  2N3904  [SOT23-3D]
Q23  2N3904  [SOT23-3D]
R120  1K  [RES-0402]
R121  1K  [RES-0402]
R122  1K  [RES-0402]
R123  1K  [RES-0402]
R124  1K  [RES-0402]
R125  1K  [RES-0402]
R126  1K  [RES-0402]

### Ports
HOME-BTN (out, see Controller-RK3562-TOP[3D]), LED-HOME (in, see Controller-RK3562-TOP[3D]), LED-PWR (in, see Controller-RK3562-TOP[3D]), POWER-BTN (out, see Controller-RK3562-TOP[3D])

### Nets
GND: K2.1 K2.2 K3.1 K3.2 Q22.2(E) Q23.2(E)
VCC-3V3-P: D11.1 D12.1 D13.1 D14.1 R120.2
NetD11_2: D11.2 R121.2
NetD12_2: D12.2 R122.2
NetD13_2: D13.2 R124.2
NetD14_2: D14.2 R125.2
NetD25_2: K3.3 K3.4 ; port POWER-BTN
NetK2_3: K2.3 K2.4 R120.1 ; port HOME-BTN
NetQ22_1: Q22.1(B) R123.1
NetQ22_3: Q22.3(C) R121.1 R122.1
NetQ23_1: Q23.1(B) R126.1
NetQ23_3: Q23.3(C) R124.1 R125.1
NetR123_2: R123.2 ; port LED-HOME
NetR126_2: R126.2 ; port LED-PWR

### Notes on the sheet
- LEDs AND BUTTONs

### Library data of the parts
D11-D14 = LED-SMD: ManufacturingPartNumber: *; Manufacturer: *; SupplierPartNumber: *; Supplier: *; VoltageRate: *
K2 K3 = kEY-4: ManufacturingPartNumber: TS36CA-0.6 250gf 031; Manufacturer: SHOU HAN(首韩); SupplierPartNumber: C2906288; Supplier: LCSC; VoltageRate: *
Q22 Q23 = NPN-SOT23: ManufacturingPartNumber: *; Manufacturer: *; SupplierPartNumber: *; Supplier: *; VoltageRate: *
R120-R126 = Resistor-1: ManufacturingPartNumber: *; Manufacturer: *; SupplierPartNumber: *; Supplier: *; VoltageRate: *

## Sheet MIPI-CAMERA.SchDoc
size 297 x 209 mm; SheetNumber: 29; SheetTotal: 32
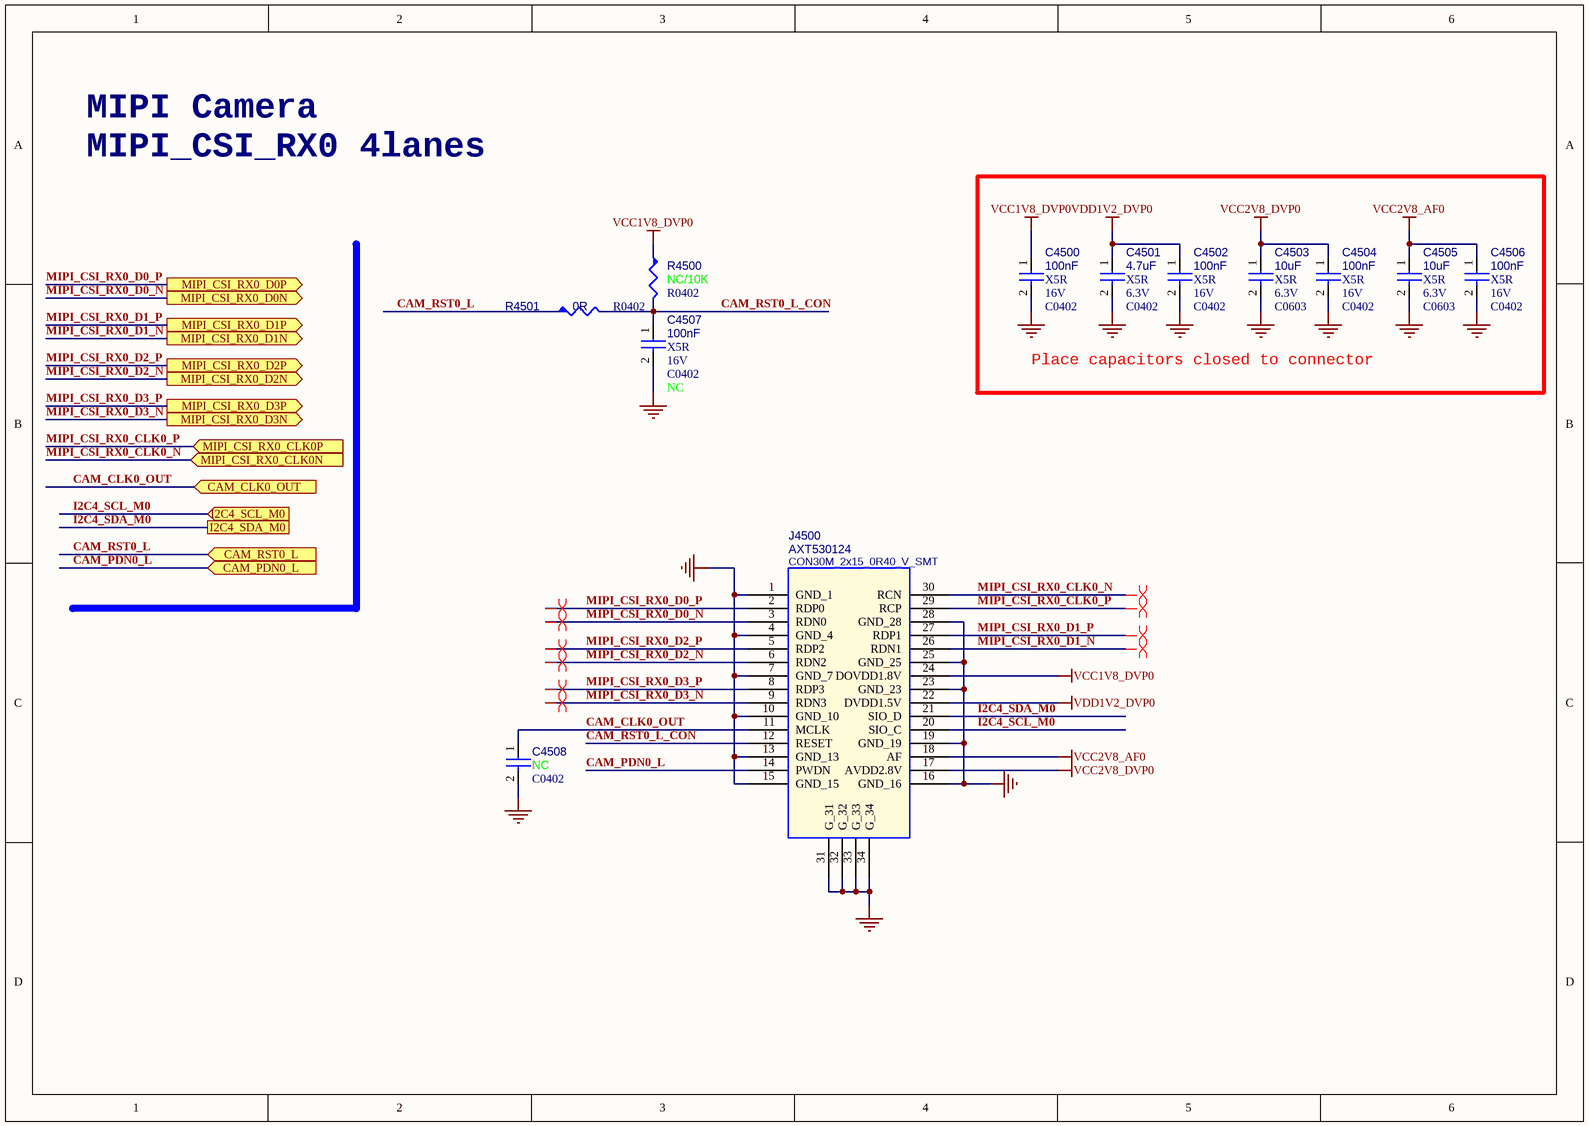
[diagram p34: MIPI-CAMERA.SchDoc]

### Parts
C4500  100nF  Dielectric: X5R  Voltage: 16V  [C0402]
C4501  4.7uF  Dielectric: X5R  Voltage: 6.3V  [C0402]
C4502  100nF  Dielectric: X5R  Voltage: 16V  [C0402]
C4503  10uF  Dielectric: X5R  Voltage: 6.3V  [C0603]
C4504  100nF  Dielectric: X5R  Voltage: 16V  [C0402]
C4505  10uF  Dielectric: X5R  Voltage: 6.3V  [C0603]
C4506  100nF  Dielectric: X5R  Voltage: 16V  [C0402]
C4507  100nF  Dielectric: X5R  Voltage: 16V  Option: NC  [C0402]
C4508  NC  [C0402]
J4500  AXT530124  PCB Footprint: CON30M_2x15_0R40_V_SMT  [CONN-SMD_30P-P0.40_AXT530124]
R4500  NC/10K  [R0402]
R4501  0R  [R0402]

### Blocks framed on the sheet
Place capacitors closed to connector: C4500-C4506

### Ports
CAM_CLK0_OUT (in, see Controller-RK3562-TOP[7B], CONTROLLER-RK3562[3C], RK3562-VCCIO5[4D]), CAM_PDN0_L (in, see Controller-RK3562-TOP[7B], CONTROLLER-RK3562[3C], RK3562-VCCIO5[4D]), CAM_RST0_L (in, see Controller-RK3562-TOP[7B], CONTROLLER-RK3562[3C], RK3562-VCCIO5[4D]), I2C4_SCL_M0 (in, see Controller-RK3562-TOP[7B], CONTROLLER-RK3562[3C], RK3562-VCCIO5[4D]), I2C4_SDA_M0 (see Controller-RK3562-TOP[7B], CONTROLLER-RK3562[3C], RK3562-VCCIO5[4D]), MIPI_CSI_RX0_CLK0N (in, see Controller-RK3562-TOP[7B], CONTROLLER-RK3562[3C], RK3562-VCCIO5[2B]), MIPI_CSI_RX0_CLK0P (in, see Controller-RK3562-TOP[7B], CONTROLLER-RK3562[3C], RK3562-VCCIO5[2A]), MIPI_CSI_RX0_D0N (out, see Controller-RK3562-TOP[7B], CONTROLLER-RK3562[3B], RK3562-VCCIO5[2A]), MIPI_CSI_RX0_D0P (out, see Controller-RK3562-TOP[7B], CONTROLLER-RK3562[3B], RK3562-VCCIO5[2A]), MIPI_CSI_RX0_D1N (out, see Controller-RK3562-TOP[7B], CONTROLLER-RK3562[3C], RK3562-VCCIO5[2A]), MIPI_CSI_RX0_D1P (out, see Controller-RK3562-TOP[7B], CONTROLLER-RK3562[3B], RK3562-VCCIO5[2A]), MIPI_CSI_RX0_D2N (out, see Controller-RK3562-TOP[7B], CONTROLLER-RK3562[3C], RK3562-VCCIO5[2A]), MIPI_CSI_RX0_D2P (out, see Controller-RK3562-TOP[7B], CONTROLLER-RK3562[3C], RK3562-VCCIO5[2A]), MIPI_CSI_RX0_D3N (out, see Controller-RK3562-TOP[7B], CONTROLLER-RK3562[3C], RK3562-VCCIO5[2A]), MIPI_CSI_RX0_D3P (out, see Controller-RK3562-TOP[7B], CONTROLLER-RK3562[3C], RK3562-VCCIO5[2A])

### Nets
GND: C4500.2 C4501.2 C4502.2 C4503.2 C4504.2 C4505.2 C4506.2 C4507.2 C4508.2 J4500.1(GND_1) J4500.4(GND_4) J4500.7(GND_7) J4500.10(GND_10) J4500.13(GND_13) J4500.15(GND_15) J4500.16(GND_16) J4500.19(GND_19) J4500.23(GND_23) J4500.25(GND_25) J4500.28(GND_28) J4500.31(G_31) J4500.32(G_32) J4500.33(G_33) J4500.34(G_34)
VCC1V8_DVP0: C4500.1 J4500.24(DOVDD1.8V) R4500.1
VCC2V8_AF0: C4505.1 C4506.1 J4500.18(AF)
VCC2V8_DVP0: C4503.1 C4504.1 J4500.17(AVDD2.8V)
VDD1V2_DVP0: C4501.1 C4502.1 J4500.22(DVDD1.5V)
CAM_CLK0_OUT: C4508.1 J4500.11(MCLK) ; port CAM_CLK0_OUT
CAM_PDN0_L: J4500.14(PWDN) ; port CAM_PDN0_L
CAM_RST0_L: R4501.1 ; port CAM_RST0_L
CAM_RST0_L_CON: C4507.1 J4500.12(RESET) R4500.2 R4501.2
I2C4_SCL_M0: J4500.20(SIO_C) ; port I2C4_SCL_M0
I2C4_SDA_M0: J4500.21(SIO_D) ; port I2C4_SDA_M0
MIPI_CSI_RX0_CLK0_N: J4500.30(RCN) ; port MIPI_CSI_RX0_CLK0N
MIPI_CSI_RX0_CLK0_P: J4500.29(RCP) ; port MIPI_CSI_RX0_CLK0P
MIPI_CSI_RX0_D0_N: J4500.3(RDN0) ; port MIPI_CSI_RX0_D0N
MIPI_CSI_RX0_D0_P: J4500.2(RDP0) ; port MIPI_CSI_RX0_D0P
MIPI_CSI_RX0_D1_N: J4500.26(RDN1) ; port MIPI_CSI_RX0_D1N
MIPI_CSI_RX0_D1_P: J4500.27(RDP1) ; port MIPI_CSI_RX0_D1P
MIPI_CSI_RX0_D2_N: J4500.6(RDN2) ; port MIPI_CSI_RX0_D2N
MIPI_CSI_RX0_D2_P: J4500.5(RDP2) ; port MIPI_CSI_RX0_D2P
MIPI_CSI_RX0_D3_N: J4500.9(RDN3) ; port MIPI_CSI_RX0_D3N
MIPI_CSI_RX0_D3_P: J4500.8(RDP3) ; port MIPI_CSI_RX0_D3P

### Layout directives
differential pair: MIPI_CSI_RX0_CLK0_N, MIPI_CSI_RX0_CLK0_P, MIPI_CSI_RX0_D0_N, MIPI_CSI_RX0_D0_P, MIPI_CSI_RX0_D1_N, MIPI_CSI_RX0_D1_P, MIPI_CSI_RX0_D2_N, MIPI_CSI_RX0_D2_P, MIPI_CSI_RX0_D3_N, MIPI_CSI_RX0_D3_P

### Notes on the sheet
- MIPI Camera
  MIPI_CSI_RX0 4lanes

### Library data of the parts
C4500 = CAP NP: cap,100.00nF,+/-10%,16V,X5R,C0402; Part Reference: C4500; Manufacturer PN: C1005X5R1C104K050BA; Manufacturer: TDK; Tolerance: 10%; Priority: A; PCB Footprint: C0402; Value: 100nF; Created by: JJJ; Part Type: C0402; RK PN: C1005X5R1C104K050BA
C4501 = CAP NP: cap,4.70uF,+/-10%,6.3V,X5R,C0402; Part Reference: C4501; Manufacturer PN: C1005X5R0J475K050BC; Manufacturer: TDK; Tolerance: 10%; Priority: A; PCB Footprint: C0402; Value: 4.7uF; Created by: JJJ; Part Type: C0402; RK PN: C1005X5R0J475K050BC
C4502 = CAP NP: cap,100.00nF,+/-10%,16V,X5R,C0402; Part Reference: C4502; Manufacturer PN: C1005X5R1C104K050BA; Manufacturer: TDK; Tolerance: 10%; Priority: A; PCB Footprint: C0402; Value: 100nF; Created by: JJJ; Part Type: C0402; RK PN: C1005X5R1C104K050BA
C4503 = CAP NP: cap,10.00uF,+/-10%,6.3V,X5R,C0603; Part Reference: C4503; Manufacturer PN: C1608X5R0J106K080AB; Manufacturer: TDK; Tolerance: 10%; Priority: A; PCB Footprint: C0603; Value: 10uF; Created by: JJJ; Part Type: C0603; RK PN: C1608X5R0J106K080AB
C4504 = CAP NP: cap,100.00nF,+/-10%,16V,X5R,C0402; Part Reference: C4504; Manufacturer: TDK; RK PN: C1005X5R1C104K050BA; Priority: A; Tolerance: 10%; PCB Footprint: C0402; Value: 100nF; Part Type: C0402; Manufacturer PN: C1005X5R1C104K050BA; Created by: JJJ
C4505 = CAP NP: cap,10.00uF,+/-10%,6.3V,X5R,C0603; Part Reference: C4505; Manufacturer: TDK; RK PN: C1608X5R0J106K080AB; Priority: A; Tolerance: 10%; PCB Footprint: C0603; Value: 10uF; Part Type: C0603; Manufacturer PN: C1608X5R0J106K080AB; Created by: JJJ
C4506 = CAP NP: cap,100.00nF,+/-10%,16V,X5R,C0402; Part Reference: C4506; Manufacturer: TDK; RK PN: C1005X5R1C104K050BA; Priority: A; Tolerance: 10%; PCB Footprint: C0402; Value: 100nF; Part Type: C0402; Manufacturer PN: C1005X5R1C104K050BA; Created by: JJJ
C4507 = CAP NP: cap,100.00nF,+/-10%,16V,X5R,C0402; Part Reference: C4507; Manufacturer PN: C1005X5R1C104K050BA; Manufacturer: TDK; Tolerance: 10%; Priority: A; PCB Footprint: C0402; Value: 100nF; Created by: JJJ; Part Type: C0402; RK PN: C1005X5R1C104K050BA
C4508 = CAP NP_NC: NC电容，无容值.; Part Reference: C4508; Optional: X; Priority: A; RK PN: 902012106-1; PCB Footprint: C0402; Value: NC; Created by: JJJ; Part Type: NC电容
J4500 = CMK-CB0077-FV1_2: Rockchips内部通用双排30PIN for MIPI CSI摄像头接口；; Part Reference: J4500; Manufacturer: Panasonic; Priority: A; Value: AXT530124; RK PN: AXT530124; Part Type: Camera Connector; Manufacturer Part Number: AXT530124; Created by: JJJ
R4500 = RESISTOR5_NC: 通用厚膜电阻,10K,+/-5%,R0402,1/16W.; Part Reference: R4500; Manufacturer: YAGEO; Manufacturer PN: RC0402JR-0710KL; Tolerance: 5%; RK PN: 901001449-1; Priority: A; Wattage: 1/16W; Optional: X; PCB Footprint: R0402; Value: NC/10K; Part Type: 通用厚膜电阻; Created by: YTL
R4501 = RESISTOR5: 通用厚膜电阻,0R,+/-5%,R0402,1/16W.; Part Reference: R4501; Manufacturer PN: RC0402JR-070RL; Manufacturer: YAGEO; Tolerance: 5%; Wattage: 1/16W; Priority: A; RK PN: 901001446; PCB Footprint: R0402; Value: 0R; Created by: YTL; Part Type: 通用厚膜电阻

## Sheet STM32G070RBT6.SchDoc
size A4; SheetNumber: 30; SheetTotal: 32
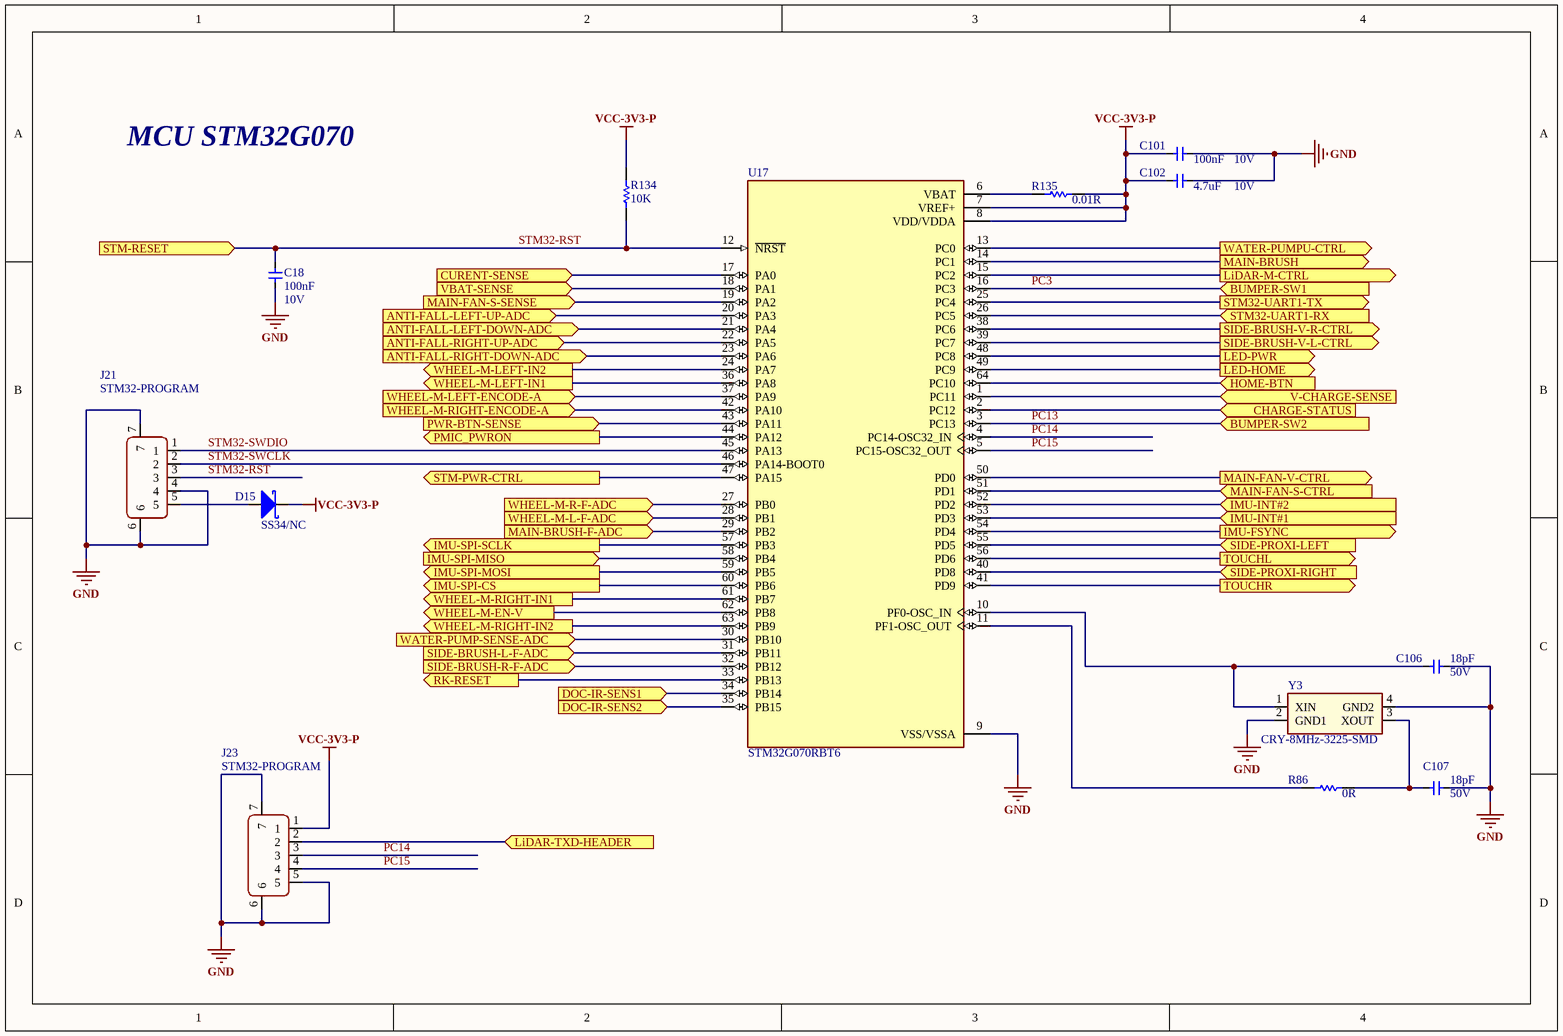
[diagram p35: STM32G070RBT6.SchDoc]

### Parts
C18  100nF  VoltageRate: 10V  [CAP-0402]
C101  100nF  VoltageRate: 10V  [CAP-0402]
C102  4.7uF  VoltageRate: 10V  [CAP-0603]
C106  18pF  VoltageRate: 50V  [CAP-0402]
C107  18pF  VoltageRate: 50V  [CAP-0402]
D15  SS34/NC  [SMA]
J21  STM32-PROGRAM  [HDR1X5]
J23  STM32-PROGRAM  [HDR1X5]
R86  0R  [RES-0402]
R134  10K  [RES-0402]
R135  0.01R  [RES-0805-S]
U17  STM32G070RBT6  [QFP50P1200X1200X160-64N]
Y3  CRY-8MHz-3225-SMD  [X4B250_320H120_SMD]

### Ports
ANTI-FALL-LEFT-DOWN-ADC (in, see Controller-RK3562-TOP[3B], ANTI-FALL-IR-SENSORs[1C]), ANTI-FALL-LEFT-UP-ADC (in, see Controller-RK3562-TOP[4B], ANTI-FALL-IR-SENSORs[1B]), ANTI-FALL-RIGHT-DOWN-ADC (in, see Controller-RK3562-TOP[3B], ANTI-FALL-IR-SENSORs[3C]), ANTI-FALL-RIGHT-UP-ADC (in, see Controller-RK3562-TOP[3B], ANTI-FALL-IR-SENSORs[3B]), BUMPER-SW1 (in, see Controller-RK3562-TOP[4B], DOCKING IR-BUMPER-SENSOR[4B]), BUMPER-SW2 (in, see Controller-RK3562-TOP[4B], DOCKING IR-BUMPER-SENSOR[4C]), CHARGE-STATUS (in, see Controller-RK3562-TOP[4C], BMS-SYSTEM-POWER[1B]), CURENT-SENSE (in, see Controller-RK3562-TOP[4C], BMS-SYSTEM-POWER[7C]), DOC-IR-SENS1 (in, see Controller-RK3562-TOP[4B], DOCKING IR-BUMPER-SENSOR[2B]), DOC-IR-SENS2 (in, see Controller-RK3562-TOP[4B], DOCKING IR-BUMPER-SENSOR[2C]), HOME-BTN (in, see Controller-RK3562-TOP[4C], BUTTON-LEDs [3B]), IMU-FSYNC (out, see Controller-RK3562-TOP[3C], IMU-ICM-4267-P [1C]), IMU-INT#1 (in, see Controller-RK3562-TOP[3C], IMU-ICM-4267-P [1B]), IMU-INT#2 (in, see Controller-RK3562-TOP[3C], IMU-ICM-4267-P [1C]), IMU-SPI-CS (out, see Controller-RK3562-TOP[3C], IMU-ICM-4267-P [1C]), IMU-SPI-MISO (in, see Controller-RK3562-TOP[3C], IMU-ICM-4267-P [1B]), IMU-SPI-MOSI (out, see Controller-RK3562-TOP[3C], IMU-ICM-4267-P [1B]), IMU-SPI-SCLK (out, see Controller-RK3562-TOP[3C], IMU-ICM-4267-P [1B]), LED-HOME (out, see Controller-RK3562-TOP[3C], BUTTON-LEDs [1B]), LED-PWR (out, see Controller-RK3562-TOP[3C], BUTTON-LEDs [1D]), LiDAR-M-CTRL (out, see Controller-RK3562-TOP[4C]), LiDAR-TXD-HEADER (in, see Controller-RK3562-TOP[4C]), MAIN-BRUSH (out, see Controller-RK3562-TOP[3B], MAIN-BRUSH-MOTOR [1C]), MAIN-BRUSH-F-ADC (in, see Controller-RK3562-TOP[3B], MAIN-BRUSH-MOTOR [1B]), MAIN-FAN-S-CTRL (in, see Controller-RK3562-TOP[3C], MAIN-FAN [2C]), MAIN-FAN-S-SENSE (in, see Controller-RK3562-TOP[3C], MAIN-FAN [2C]), MAIN-FAN-V-CTRL (out, see Controller-RK3562-TOP[3C], MAIN-FAN [2B]), PMIC_PWRON (out, see Controller-RK3562-TOP[4C], CONTROLLER-RK3562[1B], RK-POWER-SUPPLY[1A]), PWR-BTN-SENSE (in, see Controller-RK3562-TOP[4C], BMS-SYSTEM-POWER[5D]), RK-RESET (out, see Controller-RK3562-TOP[4B], CONTROLLER-RK3562[7A]), SIDE-BRUSH-L-F-ADC (in, see Controller-RK3562-TOP[3C], SIDE-BRUSH-MOTORs [2C]), SIDE-BRUSH-R-F-ADC (in, see Controller-RK3562-TOP[3C], SIDE-BRUSH-MOTORs [2B]), SIDE-BRUSH-V-L-CTRL (out, see Controller-RK3562-TOP[3C], SIDE-BRUSH-MOTORs [2D]), SIDE-BRUSH-V-R-CTRL (out, see Controller-RK3562-TOP[3C], SIDE-BRUSH-MOTORs [2B]), SIDE-PROXI-LEFT (in, see Controller-RK3562-TOP[4B], SIDE-PROXIMITY-IR-SENSOR [2A]), SIDE-PROXI-RIGHT (in, see Controller-RK3562-TOP[4B], SIDE-PROXIMITY-IR-SENSOR [1C]), STM32-UART1-RX (in, see Controller-RK3562-TOP[4B]), STM32-UART1-TX (out, see Controller-RK3562-TOP[4B]), STM-PWR-CTRL (out, see Controller-RK3562-TOP[4C], BMS-SYSTEM-POWER[7D]), STM-RESET (in, see Controller-RK3562-TOP[4B], CONTROLLER-RK3562[3D], RK3562-VCCIO6[4C]), TOUCHL (out, see Controller-RK3562-TOP[4B], SIDE-PROXIMITY-IR-SENSOR [2B]), TOUCHR (out, see Controller-RK3562-TOP[4B], SIDE-PROXIMITY-IR-SENSOR [2C]), V-CHARGE-SENSE (in, see Controller-RK3562-TOP[4C], BMS-SYSTEM-POWER[8B]), VBAT-SENSE (in, see Controller-RK3562-TOP[4C], BMS-SYSTEM-POWER[7C]), WATER-PUMP-SENSE-ADC (in, see Controller-RK3562-TOP[3B], WATER-PUMP [1C]), WATER-PUMPU-CTRL (out, see Controller-RK3562-TOP[3B], WATER-PUMP [1B]), WHEEL-M-EN-V (out, see Controller-RK3562-TOP[3B], WHEEL-MOTORs [4B]), WHEEL-M-L-F-ADC (in, see Controller-RK3562-TOP[3C], WHEEL-MOTORs [1D]), WHEEL-M-LEFT-ENCODE-A (in, see Controller-RK3562-TOP[3C], WHEEL-MOTORs [2D]), WHEEL-M-LEFT-IN1 (out, see Controller-RK3562-TOP[3B], WHEEL-MOTORs [1C]), WHEEL-M-LEFT-IN2 (out, see Controller-RK3562-TOP[3B], WHEEL-MOTORs [1C]), WHEEL-M-R-F-ADC (in, see Controller-RK3562-TOP[3C], WHEEL-MOTORs [1B]), WHEEL-M-RIGHT-ENCODE-A (in, see Controller-RK3562-TOP[3B], WHEEL-MOTORs [2B]), WHEEL-M-RIGHT-IN1 (out, see Controller-RK3562-TOP[3B], WHEEL-MOTORs [1A]), WHEEL-M-RIGHT-IN2 (out, see Controller-RK3562-TOP[3B], WHEEL-MOTORs [1A])

### Nets
GND: C18.2 C101.1 C102.1 C106.1 C107.1 J21.4 J21.6 J21.7 J23.5 J23.6 J23.7 U17.9(VSS/VSSA) Y3.2(GND1) Y3.4(GND2)
VCC-3V3-P: C101.2 C102.2 D15.2(K) J23.1 R134.1 R135.1 U17.7(VREF+) U17.8(VDD/VDDA)
IMU-CS: U17.60(PB6) ; port IMU-SPI-CS
IMU-FSYNC: U17.54(PD4) ; port IMU-FSYNC
IMU-INT1: U17.53(PD3) ; port IMU-INT#1
IMU-INT2: U17.52(PD2) ; port IMU-INT#2
IMU-MISO: U17.58(PB4) ; port IMU-SPI-MISO
IMU-MOSI: U17.59(PB5) ; port IMU-SPI-MOSI
IMU-SCLK: U17.57(PB3) ; port IMU-SPI-SCLK
LiDAR-M-CTRL: U17.15(PC2) ; port LiDAR-M-CTRL
LiDAR-TXD: J23.2 ; port LiDAR-TXD-HEADER
PC3: U17.16(PC3) ; port BUMPER-SW1
PC13: U17.3(PC13) ; port BUMPER-SW2
PC14: J23.3 U17.4(PC14-OSC32_IN)
PC15: J23.4 U17.5(PC15-OSC32_OUT)
PMIC_PWRON: U17.44(PA12) ; port PMIC_PWRON
RESETn: U17.33(PB13) ; port RK-RESET
STM32-RST: C18.1 J21.3 R134.2 U17.12(~{NRST}) ; port STM-RESET
STM32-SWCLK: J21.2 U17.46(PA14-BOOT0)
STM32-SWDIO: J21.1 U17.45(PA13)
UART9_RXD_M0: U17.25(PC4) ; port STM32-UART1-TX
UART9_TXD_M0: U17.26(PC5) ; port STM32-UART1-RX
NetC92_1: U17.19(PA2) ; port MAIN-FAN-S-SENSE
NetC106_2: C106.2 U17.10(PF0-OSC_IN) Y3.1(XIN)
NetC107_2: C107.2 R86.2 Y3.3(XOUT)
NetD15_1: D15.1(A) J21.5
NetD17_1: U17.30(PB10) ; port WATER-PUMP-SENSE-ADC
NetD18_1: U17.29(PB2) ; port MAIN-BRUSH-F-ADC
NetD19_1: U17.27(PB0) ; port WHEEL-M-R-F-ADC
NetD20_1: U17.28(PB1) ; port WHEEL-M-L-F-ADC
NetD21_1: U17.32(PB12) ; port SIDE-BRUSH-R-F-ADC
NetD22_1: U17.31(PB11) ; port SIDE-BRUSH-L-F-ADC
NetD25_1: U17.43(PA11) ; port PWR-BTN-SENSE
NetIR1_1: U17.34(PB14) ; port DOC-IR-SENS1
NetIR2_1: U17.35(PB15) ; port DOC-IR-SENS2
NetJ4_4: U17.20(PA3) ; port ANTI-FALL-LEFT-UP-ADC
NetJ4_8: U17.21(PA4) ; port ANTI-FALL-LEFT-DOWN-ADC
NetJ5_4: U17.22(PA5) ; port ANTI-FALL-RIGHT-UP-ADC
NetJ5_8: U17.23(PA6) ; port ANTI-FALL-RIGHT-DOWN-ADC
NetJ8_1: U17.55(PD5) ; port SIDE-PROXI-LEFT
NetJ9_1: U17.40(PD8) ; port SIDE-PROXI-RIGHT
NetK2_3: U17.64(PC10) ; port HOME-BTN
NetQ10_1: U17.14(PC1) ; port MAIN-BRUSH
NetQ16_1: U17.38(PC6) ; port SIDE-BRUSH-V-R-CTRL
NetQ18_1: U17.39(PC7) ; port SIDE-BRUSH-V-L-CTRL
NetR5_1: U17.2(PC12) ; port CHARGE-STATUS
NetR9_1: U17.1(PC11) ; port V-CHARGE-SENSE
NetR27_2: U17.13(PC0) ; port WATER-PUMPU-CTRL
NetR28_2: U17.47(PA15) ; port STM-PWR-CTRL
NetR30_2: U17.18(PA1) ; port VBAT-SENSE
NetR77_1: U17.56(PD6) ; port TOUCHL
NetR80_1: U17.41(PD9) ; port TOUCHR
NetR86_1: R86.1 U17.11(PF1-OSC_OUT)
NetR89_1: U17.63(PB9) ; port WHEEL-M-RIGHT-IN2
NetR90_1: U17.61(PB7) ; port WHEEL-M-RIGHT-IN1
NetR91_2: U17.62(PB8) ; port WHEEL-M-EN-V
NetR95_1: U17.42(PA10) ; port WHEEL-M-RIGHT-ENCODE-A
NetR97_1: U17.24(PA7) ; port WHEEL-M-LEFT-IN2
NetR98_1: U17.36(PA8) ; port WHEEL-M-LEFT-IN1
NetR102_1: U17.37(PA9) ; port WHEEL-M-LEFT-ENCODE-A
NetR104_1: U17.50(PD0) ; port MAIN-FAN-V-CTRL
NetR105_2: U17.51(PD1) ; port MAIN-FAN-S-CTRL
NetR123_2: U17.49(PC9) ; port LED-HOME
NetR126_2: U17.48(PC8) ; port LED-PWR
NetR135_2: R135.2 U17.6(VBAT)
NetU6_1: U17.17(PA0) ; port CURENT-SENSE

### Notes on the sheet
- MCU STM32G070

### Library data of the parts
C18 C101 C102 C106 C107 = Capacitor-1: ManufacturingPartNumber: *; Manufacturer: *; SupplierPartNumber: *; Supplier: *
D15 = DIODE-2: ManufacturingPartNumber: *; Manufacturer: *; SupplierPartNumber: *; Supplier: *; VoltageRate: *
J21 J23 = HDRx5: ManufacturingPartNumber: *; Manufacturer: *; SupplierPartNumber: *; Supplier: *; VoltageRate: *
R86 R134 R135 = Resistor-1: ManufacturingPartNumber: *; Manufacturer: *; SupplierPartNumber: *; Supplier: *; VoltageRate: *
Y3 = CRY-24MHz-3225-SMD_0: ManufacturingPartNumber: *; Manufacturer: *; SupplierPartNumber: *; Supplier: *; VoltageRate: *
U17 = STM32G070RBT6: ManufacturingPartNumber: *; Manufacturer: *; SupplierPartNumber: *; Supplier: *; VoltageRate: *